# EAGLE schematic bilancia_smart_full (EAGLE 7.1.0)
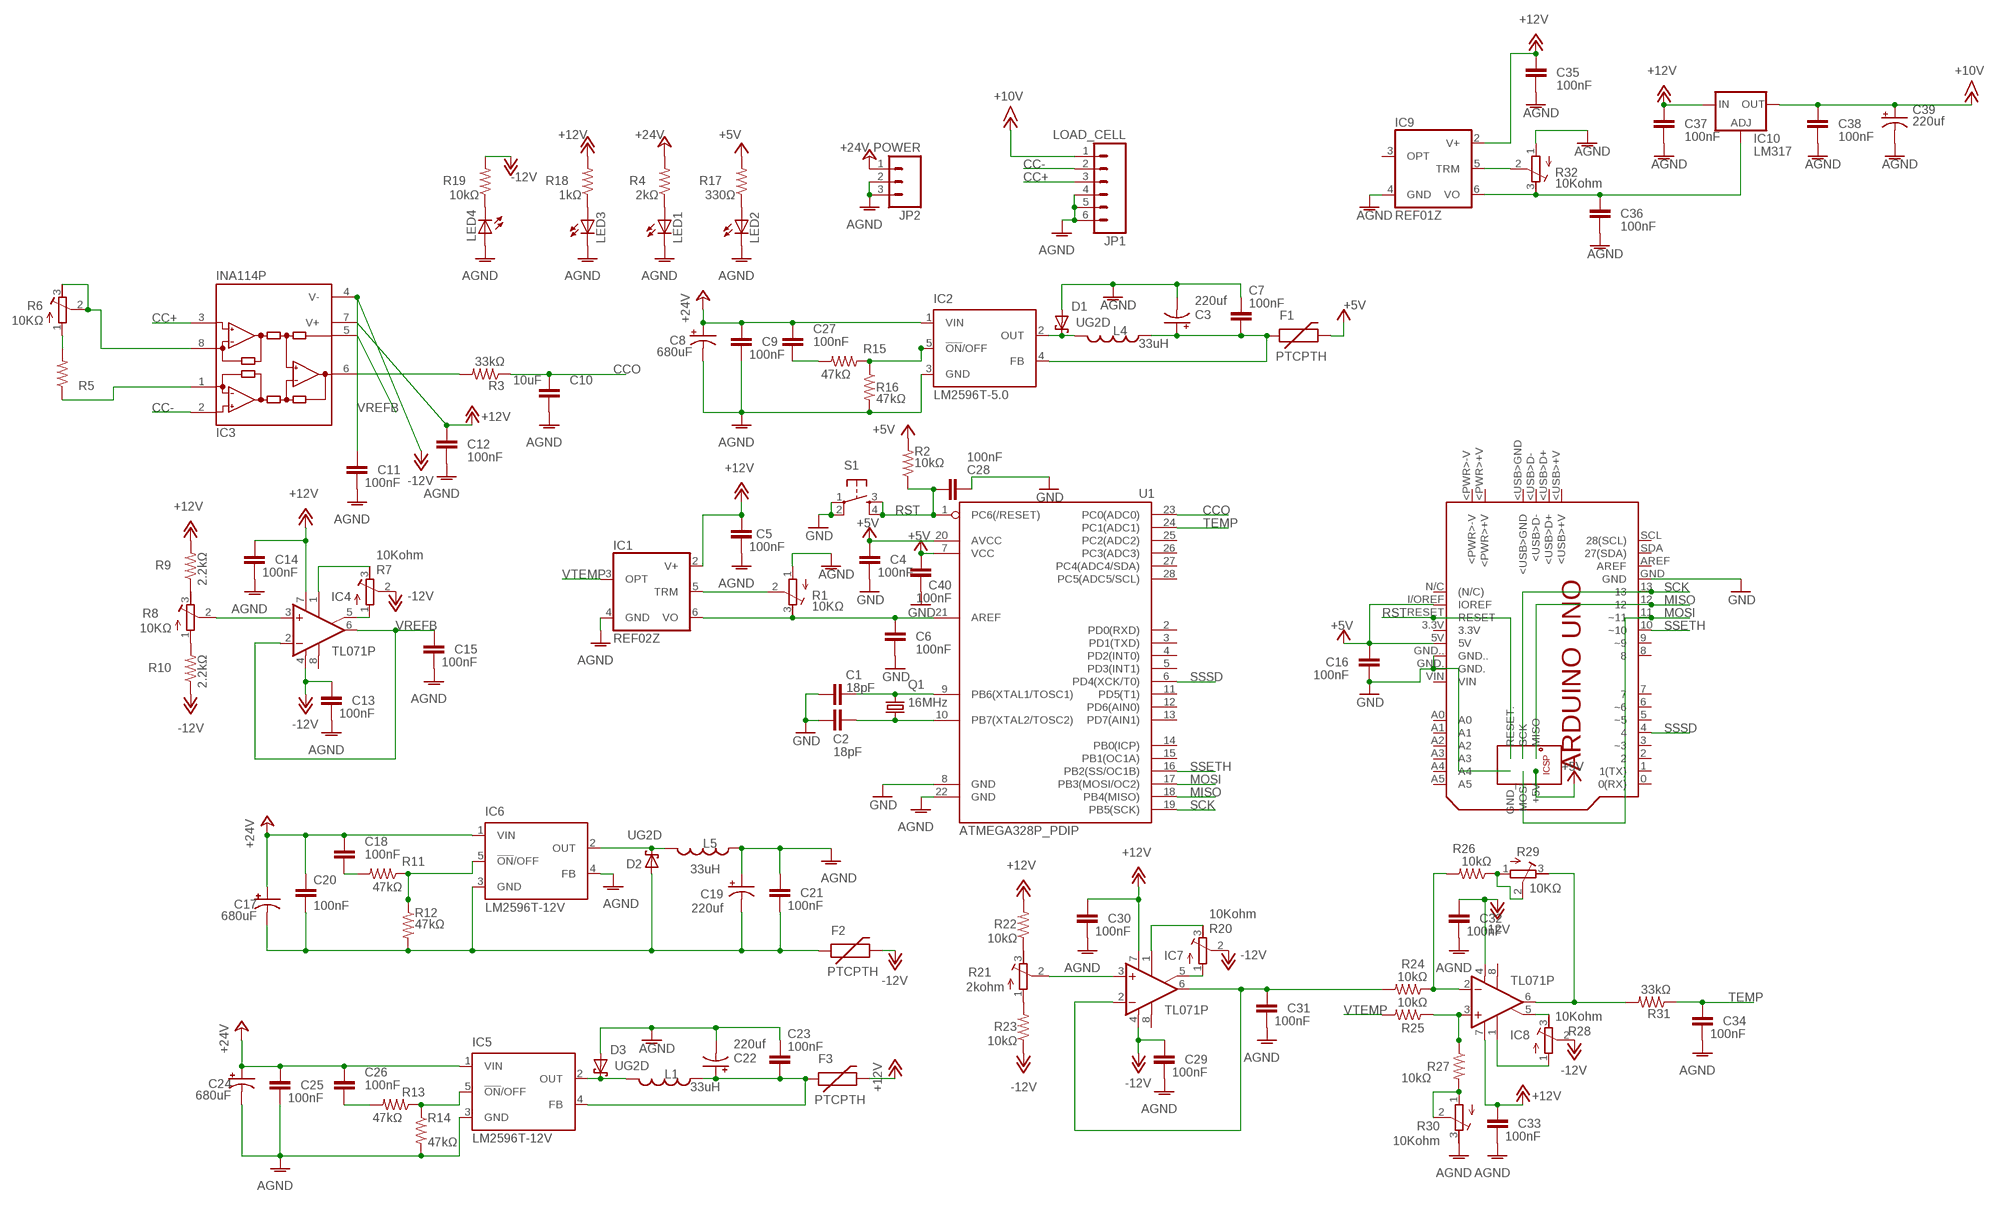
[diagram p0: schematic, sheet 1]

## Parts
C1  18pF  C2.5/2  [C2.5-2]
C2  18pF  C2.5/2  [C2.5-2]
C3  220uf  CPOL-USE5-8.5  [E5-8,5]
C4  100nF  C2.5/2  [C2.5-2]
C5  100nF  C2.5/2  [C2.5-2]
C6  100nF  C2.5/2  [C2.5-2]
C7  100nF  C2.5/2  [C2.5-2]
C8  680uF  CPOL-USE5-8.5  [E5-8,5]
C9  100nF  C2.5/2  [C2.5-2]
C10  10uF  C2.5/2  [C2.5-2]
C11  100nF  C2.5/2  [C2.5-2]
C12  100nF  C2.5/2  [C2.5-2]
C13  100nF  C2.5/2  [C2.5-2]
C14  100nF  C2.5/2  [C2.5-2]
C15  100nF  C2.5/2  [C2.5-2]
C16  100nF  C2.5/2  [C2.5-2]
C17  680uF  CPOL-USE5-8.5  [E5-8,5]
C18  100nF  C2.5/2  [C2.5-2]
C19  220uf  CPOL-USE5-8.5  [E5-8,5]
C20  100nF  C2.5/2  [C2.5-2]
C21  100nF  C2.5/2  [C2.5-2]
C22  220uf  CPOL-USE5-8.5  [E5-8,5]
C23  100nF  C2.5/2  [C2.5-2]
C24  680uF  CPOL-USE5-8.5  [E5-8,5]
C25  100nF  C2.5/2  [C2.5-2]
C26  100nF  C2.5/2  [C2.5-2]
C27  100nF  C2.5/2  [C2.5-2]
C28  100nF  C2.5/2  [C2.5-2]
C29  100nF  C2.5/2  [C2.5-2]
C30  100nF  C2.5/2  [C2.5-2]
C31  100nF  C2.5/2  [C2.5-2]
C32  100nF  C2.5/2  [C2.5-2]
C33  100nF  C2.5/2  [C2.5-2]
C34  100nF  C2.5/2  [C2.5-2]
C35  100nF  C2.5/2  [C2.5-2]
C36  100nF  C2.5/2  [C2.5-2]
C37  100nF  C2.5/2  [C2.5-2]
C38  100nF  C2.5/2  [C2.5-2]
C39  220uf  CPOL-USE5-8.5  [E5-8,5]
C40  100nF  C2.5/2  [C2.5-2]
D1  UG2D  SCHOTTKY-DIODEDO41-7  [DO41-7]
D2  UG2D  SCHOTTKY-DIODEDO41-7  [DO41-7]
D3  UG2D  SCHOTTKY-DIODEDO41-7  [DO41-7]
F1  PTCPTH  [PTC]
F2  PTCPTH  [PTC]
F3  PTCPTH  [PTC]
IC1  REF02Z  [DIL08]
IC2  LM2596T-5.0  LM2596T  [T05D]
IC3  INA114P  [DIL08]
IC4  TL071P  [DIL08]
IC5  LM2596T-12V  LM2596T  [T05D]
IC6  LM2596T-12V  LM2596T  [T05D]
IC7  TL071P  [DIL08]
IC8  TL071P  [DIL08]
IC9  REF01Z  [DIL08]
IC10  LM317  LM317TL  [317TL]
JP1  LOAD_CELL  M06SIP  [1X06]
JP2  POWER  M03PTH  [1X03]
L1  33uH  INDUCTORRLB0912  [RLB0912]
L4  33uH  INDUCTORRLB0912  [RLB0912]
L5  33uH  INDUCTORRLB0912  [RLB0912]
LED1  MINIMIDI_LED5MM  [MINIMIDI_LED5MM]
LED2  MINIMIDI_LED5MM  [MINIMIDI_LED5MM]
LED3  MINIMIDI_LED5MM  [MINIMIDI_LED5MM]
LED4  MINIMIDI_LED5MM  [MINIMIDI_LED5MM]
PCB1  ARDUINO_UNO  [ARDUINO_UNO]
Q1  16MHz  CRYSTALHC49S  [HC49/S]
R1  10KΩ  R-TRIMM64W  [RTRIM64W]
R2  10kΩ  R-US_0207/10  [0207/10]
R3  33kΩ  R-US_0207/10  [0207/10]
R4  2kΩ  R-US_0207/10  [0207/10]
R5  R-US_0207/10  [0207/10]
R6  10KΩ  R-TRIMM64W  [RTRIM64W]
R7  10Kohm  R-TRIMM64W  [RTRIM64W]
R8  10KΩ  R-TRIMM64W  [RTRIM64W]
R9  2.2kΩ  R-US_0207/10  [0207/10]
R10  2.2kΩ  R-US_0207/10  [0207/10]
R11  47kΩ  R-US_0207/10  [0207/10]
R12  47kΩ  R-US_0207/10  [0207/10]
R13  47kΩ  R-US_0207/10  [0207/10]
R14  47kΩ  R-US_0207/10  [0207/10]
R15  47kΩ  R-US_0207/10  [0207/10]
R16  47kΩ  R-US_0207/10  [0207/10]
R17  330Ω  R-US_0207/10  [0207/10]
R18  1kΩ  R-US_0207/10  [0207/10]
R19  10kΩ  R-US_0207/10  [0207/10]
R20  10Kohm  R-TRIMM64W  [RTRIM64W]
R21  2kohm  R-TRIMM64W  [RTRIM64W]
R22  10kΩ  R-US_0207/10  [0207/10]
R23  10kΩ  R-US_0207/10  [0207/10]
R24  10kΩ  R-US_0207/10  [0207/10]
R25  10kΩ  R-US_0207/10  [0207/10]
R26  10kΩ  R-US_0207/10  [0207/10]
R27  10kΩ  R-US_0207/10  [0207/10]
R28  10Kohm  R-TRIMM64W  [RTRIM64W]
R29  10KΩ  R-TRIMM64W  [RTRIM64W]
R30  10Kohm  R-TRIMM64W  [RTRIM64W]
R31  33kΩ  R-US_0207/10  [0207/10]
R32  10Kohm  R-TRIMM64W  [RTRIM64W]
S1  TAC_SWITCHPTH  [TACTILE-PTH]
U1  ATMEGA328P_PDIP  [DIL28-3]

## Nets
+5V: C4.2 C16.2 C40.2 F1.P$2 PCB1.5V PCB1.+5V PCB1.I/OREF(IOREF) R2.2 R17.2 U1.7(VCC) U1.20(AVCC)
+12V: C5.1 C12.2 C14.2 C30.2 C33.2 C35.2 C37.2 F3.P$2 IC1.2(V+) IC3.7(V+) IC4.7(V+) IC7.7(V+) IC8.7(V+) IC9.2(V+) IC10.3(IN) R9.2 R18.2 R22.2
+15V: C38.2 C39.+ IC10.2(OUT) JP1.1 ; supply symbol labelled +10V
+24V: C8.+ C9.1 C17.+ C18.1 C20.1 C24.+ C25.1 C26.1 C27.1 IC2.1(VIN) IC5.1(VIN) IC6.1(VIN) JP2.1 R4.2
-12V: C11.2 C13.2 C29.2 C32.2 F2.P$2 IC3.4(V-) IC4.4(V-) IC7.4(V-) IC8.4(V-) R7.2(S) R10.1 R19.2 R20.2(S) R23.1 R28.2(S)
AGND: C3.- C5.2 C7.2 C8.- C9.2 C10.1 C11.1 C12.1 C13.1 C14.1 C15.1 C19.+ C21.1 C22.- C23.2 C24.- C25.2 C29.1 C30.1 C31.1 C32.1 C33.1 C34.1 C35.1 C36.1 C37.1 C38.1 C39.- D1.A D3.A IC1.4(GND) IC2.3(GND) IC5.3(GND) IC6.4(FB) IC9.4(GND) JP1.4 JP1.5 JP1.6 JP2.2 JP2.3 L5.1 LED1.K(C) LED2.K(C) LED3.K(C) LED4.A R1.1(E) R14.2 R16.2 R30.3(A) R32.1(E) U1.22(GND)
CC+: IC3.3(+IN) JP1.3
CC-: IC3.2(-IN) JP1.2
CCO: C10.2 R3.1 U1.23(PC0(ADC0))
GND: C1.1 C2.1 C4.1 C6.1 C16.1 C28.1 C40.1 PCB1.GND PCB1.GND. PCB1.GND.. PCB1.GND_ S1.1 S1.2 U1.8(GND)
MISO: PCB1.12 PCB1.MISO U1.18(PB4(MISO))
MOSI: PCB1.11(~11) PCB1.MOSI U1.17(PB3(MOSI/OC2))
N$1: C6.2 IC1.6(VO) R1.3(A) U1.21(AREF)
N$2: C2.2 Q1.2 U1.10(PB7(XTAL2/TOSC2))
N$3: C1.2 Q1.1 U1.9(PB6(XTAL1/TOSC1))
N$4: LED2.A R17.1
N$5: IC1.5(TRM) R1.2(S)
N$6: C3.+ C7.1 F1.P$1 IC2.4(FB) L4.1
N$7: IC3.6(OUT) R3.2
N$8: LED1.A R4.1
N$9: R5.2 R6.1(E)
N$10: IC3.8(RG) R6.2(S) R6.3(A)
N$11: IC3.1(RG) R5.1
N$12: IC4.5(ON2) R7.1(E)
N$13: IC4.1(ON1) R7.3(A)
N$14: IC6.5(!ON!/OFF) R11.1 R12.1
N$15: R8.3(A) R9.1
N$16: R8.1(E) R10.2
N$17: IC4.3(+IN) R8.2(S)
N$18: C18.2 R11.2
N$19: D1.C IC2.2(OUT) L4.2
N$20: D2.C IC6.2(OUT) L5.2
N$21: C22.+ C23.1 F3.P$1 IC5.4(FB) L1.1
N$22: C17.- C19.- C20.2 C21.2 D2.A F2.P$1 IC6.3(GND) R12.2
N$23: D3.C IC5.2(OUT) L1.2
N$24: IC5.5(!ON!/OFF) R13.1 R14.1
N$25: C26.2 R13.2
N$26: IC2.5(!ON!/OFF) R15.1 R16.1
N$27: C27.2 R15.2
N$28: LED3.A R18.1
N$29: LED4.K(C) R19.1
N$30: IC7.5(ON2) R20.1(E)
N$31: IC7.1(ON1) R20.3(A)
N$32: R21.3(A) R22.1
N$33: R21.1(E) R23.2
N$34: IC7.3(+IN) R21.2(S)
N$35: C31.2 IC7.2(-IN) IC7.6(OUT) R24.2
N$36: IC8.2(-IN) R24.1 R26.2
N$37: IC8.3(+IN) R25.1 R27.1
N$38: IC8.5(ON2) R28.3(A)
N$39: IC8.1(ON1) R28.1(E)
N$40: R26.1 R29.1(E) R29.2(S)
N$41: R27.2 R30.1(E) R30.2(S)
N$42: C36.2 IC9.6(VO) IC10.1(ADJ) R32.3(A)
N$43: IC9.5(TRM) R32.2(S)
N$45: IC8.6(OUT) R29.3(A) R31.2
RST: C28.2 PCB1.RESET PCB1.RESET. R2.1 S1.3 S1.4 U1.1(PC6(/RESET))
SCK: PCB1.13 PCB1.SCK U1.19(PB5(SCK))
SSETH: PCB1.10(~10) U1.16(PB2(SS/OC1B))
SSSD: PCB1.4 U1.6(PD4(XCK/T0))
TEMP: C34.2 R31.1 U1.24(PC1(ADC1))
VREFB: C15.2 IC3.5(REF) IC4.2(-IN) IC4.6(OUT)
VTEMP: IC1.3(OPT) R25.2
Unconnected: IC4.8(OPT) IC7.8(OPT) IC8.8(OPT) IC9.3(OPT) PCB1.0(0(RX)) PCB1.1(1(TX)) PCB1.2 PCB1.3(~3) PCB1.3.3V PCB1.5(~5) PCB1.6(~6) PCB1.7 PCB1.8 PCB1.9(~9) PCB1.<PWR>+V PCB1.<PWR>-V PCB1.<USB>+V PCB1.<USB>D+ PCB1.<USB>D- PCB1.<USB>GND PCB1.A0 PCB1.A1 PCB1.A2 PCB1.A3 PCB1.A4 PCB1.A5 PCB1.AREF PCB1.N/C((N/C)) PCB1.SCL(28(SCL)) PCB1.SDA(27(SDA)) PCB1.VIN U1.2(PD0(RXD)) U1.3(PD1(TXD)) U1.4(PD2(INT0)) U1.5(PD3(INT1)) U1.11(PD5(T1)) U1.12(PD6(AIN0)) U1.13(PD7(AIN1)) U1.14(PB0(ICP)) U1.15(PB1(OC1A)) U1.25(PC2(ADC2)) U1.26(PC3(ADC3)) U1.27(PC4(ADC4/SDA)) U1.28(PC5(ADC5/SCL))

## Library data of the parts
C1 C2 C4-C7 C9-C16 C18 C20 C21 C23 C25-C38 C40 = capacitor-wima:C: CAPACITOR naming: grid - package width
C3 C8 C17 C19 C22 C24 C39 = resistor:CPOL-US: POLARIZED CAPACITOR, American symbol
D1-D3 = adafruit:SCHOTTKY-DIODE: Schottky Diode
F1-F3 = SparkFun-PowerIC:PTC: Resettable Fuse PTC Resettable Fuse. Spark Fun Electronics SKU : COM-08357
IC1 = linear:REF02: VOLTAGE REFERENCE
IC2 IC5 IC6 = national-semiconductor:LM2596: SIMPLE SWITCHER® Power Converter 150 kHz 3A Step-Down Voltage Regulator Source: http://www.national.com/ds/LM/LM2596.pdf; MPN: LM2596T-ADJ/LF02; OC_FARNELL: 9494162; OC_NEWARK: 65K5910
IC3 = burr-brown:INA114: Precision Instrumentation Amplifier; MF: TEXAS INSTRUMENTS; MPN: INA114BP; OC_FARNELL: 1212399; OC_NEWARK: 74K3810
IC4 IC7 IC8 = linear:TL071: OP AMP
IC9 = linear:REF01: VOLTAGE REFERENCE
IC10 = v-reg:LM317TL: VOLTAGE REGULATOR
JP1 = SparkFun-Connectors:M06: Header 6 Standard 6-pin 0.1" header. Use with straight break away headers (SKU : PRT-00116), right angle break away headers (PRT-00553), swiss pins (PRT-00743), machine pins (PRT-00117), and female headers (PRT-00115). Molex polarized connector foot print use with SKU : PRT-08094 with associated crimp pins and housings. NOTES ON THE VARIANTS LOCK and LOCK_LONGPADS... This footprint was designed to help hold the alignment of a through-hole component (i.e. 6-pin header) while soldering it into place. You may notice that each hole has been shifted either up or down by 0.005 of an inch from it's more standard position (which is a perfectly straight line). This slight alteration caused the pins (the squares in the middle) to touch the edges of the holes. Because they are alternating, it causes a "brace" to hold the component in place. 0.005 has proven to be the perfect amount of "off-center" position when using our standard breakaway headers. Although looks a little odd when you look at the bare footprint, once you have a header in there, the alteration is very hard to notice. Also,if you push a header all the way into place, it is covered up entirely on the bottom side. This idea of altering the position of holes to aid alignment will be further integrated into the Sparkfun Library for other footprints. It can help hold any component with 3 or more connection pins.
JP2 = SparkFun-Connectors:M03: Header 3 Standard 3-pin 0.1" header. Use with straight break away headers (SKU : PRT-00116), right angle break away headers (PRT-00553), swiss pins (PRT-00743), machine pins (PRT-00117), and female headers (PRT-00115). Molex polarized connector foot print use with SKU : PRT-08232 with associated crimp pins and housings.
L1 L4 L5 = SparkFun-Passives:INDUCTOR: Inductors Basic Inductor/Choke - 0603 and 1206. Footprints are not proven and vary greatly between part numbers. SRN6045- 33uH, 20% 1.4A
LED1-LED4 = AF_mshield-v1 (1):MINIMIDI_LED: LED OSRAM: - CHIPLED LG R971, LG N971, LY N971, LG Q971, LY Q971, LO R971, LY R971 LH N974, LH R974 LS Q976, LO Q976, LY Q976 LO Q996 - Hyper CHIPLED LW Q18S LB Q993, LB Q99A, LB R99A - SideLED LS A670, LO A670, LY A670, LG A670, LP A670 LB A673, LV A673, LT A673, LW A673 LH A674 LY A675 LS A676, LA A676, LO A676, LY A676, LW A676 LS A679, LY A679, LG A679 - Hyper Micro SIDELED® LS Y876, LA Y876, LO Y876, LY Y876 LT Y87S - SmartLED LW L88C, LW L88S LB L89C, LB L89S, LG L890 LS L89K, LO L89K, LY L89K LS L896, LA L896, LO L896, LY L896 - TOPLED LS T670, LO T670, LY T670, LG T670, LP T670 LSG T670, LSP T670, LSY T670, LOP T670, LYG T670 LG T671, LOG T671, LSG T671 LB T673, LV T673, LT T673, LW T673 LH T674 LS T676, LA T676, LO T676, LY T676, LB T676, LH T676, LSB T676, LW T676 LB T67C, LV T67C, LT T67C, LS T67K, LO T67K, LY T67K, LW E67C LS E67B, LA E67B, LO E67B, LY E67B, LB E67C, LV E67C, LT E67C LW T67C LS T679, LY T679, LG T679 LS T770, LO T770, LY T770, LG T770, LP T770 LB T773, LV T773, LT T773, LW T773 LH T774 LS E675, LA E675, LY E675, LS T675 LS T776, LA T776, LO T776, LY T776, LB T776 LHGB T686 LT T68C, LB T68C - Hyper Mini TOPLED® LB M676 - Mini TOPLED Santana® LG M470 LS M47K, LO M47K, LY M47K Source: http://www.osram.convergy.de/
PCB1 = E14_Arduino:ARDUINO_UNO: Device for representing an Arduino Uno board with a footprint in an EAGLE design. Created by Dave Young for Element14. More EAGLE documentation at: http://www.element14.com/community/community/knode/cadsoft_eagle
Q1 = adafruit:CRYSTAL: CRYSTAL; OC_FARNELL: 1667008; OC_NEWARK: unknown
R1 R6-R8 R20 R21 R28-R30 R32 = resistor:R-TRIMM: Trimm resistor
R2-R5 R9-R19 R22-R27 R31 = resistor:R-US_: RESISTOR, American symbol
S1 = SparkFun-Electromechanical:TAC_SWITCH: Momentary Switch Button commonly used for reset or general input. Spark Fun Electronics SKU : COM-00097 SMT- SWCH-08247
U1 = SparkFun-DigitalIC:ATMEGA328P_PDIP: uC used in the Arduino 32kb flash, 1k EEPROM, 2k SRAM This is the through-hole version of this chip.